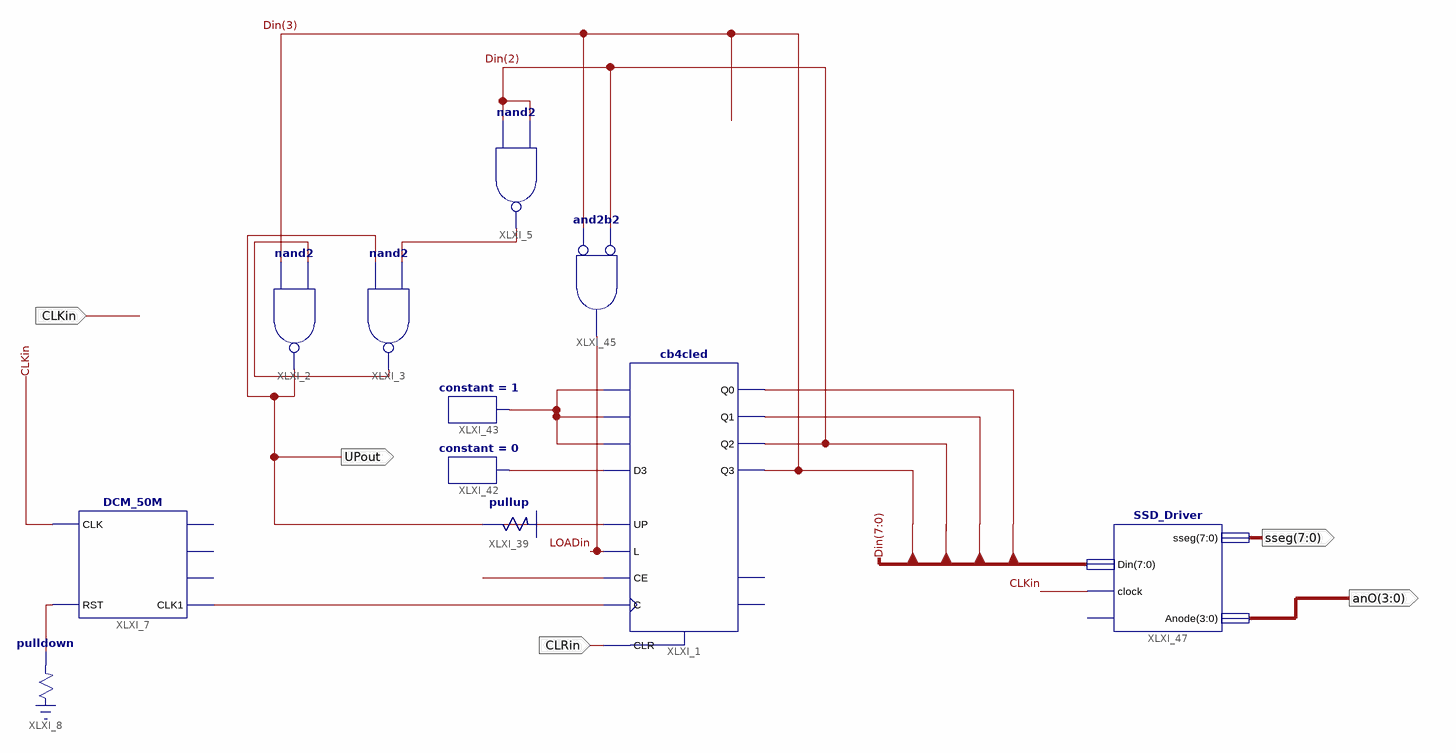
[diagram p0: schematic sheet 1]
// Xilinx ISE schematic Lab8_Experiment7.sch (spartan3e) as structural Verilog: 11 symbols, 5 ports
module Lab8_Experiment7 (
  input  CLKin,
  input  CLRin,
  output [7:0] sseg,
  output [3:0] anO,
  output UPout
);

  wire LOADin, XLXN_4, XLXN_5, XLXN_26, XLXN_43, XLXN_47, XLXN_49, XLXN_54;
  wire [7:0] Din;

  cb4cled XLXI_1 (
    .C(XLXN_5), .CE(XLXN_26), .CLR(CLRin), .D0(XLXN_54), .D1(XLXN_54), .D2(XLXN_54), .D3(XLXN_49),
    .L(LOADin), .UP(UPout), .Q0(Din[0]), .Q1(Din[1]), .Q2(Din[2]), .Q3(Din[3]));  // open: CEO, TC
  DCM_50M XLXI_7 (.CLK(CLKin), .RST(XLXN_4), .CLK1(XLXN_5));  // open: CLK1M, CLK10k, CLK1k
  \pulldown  XLXI_8 (.O(XLXN_4));
  \pullup  XLXI_39 (.O(XLXN_26));
  nand XLXI_5 (XLXN_47, Din[2], Din[2]);
  nand XLXI_2 (UPout, Din[3], XLXN_43);
  nand XLXI_3 (XLXN_43, UPout, XLXN_47);
  constant #(.CValue("0")) XLXI_42 (.O(XLXN_49));
  constant #(.CValue("1")) XLXI_43 (.O(XLXN_54));
  and XLXI_45 (LOADin, ~Din[3], ~Din[2]);  // and2b2
  SSD_Driver XLXI_47 (.Din(Din), .clock(CLKin), .sseg(sseg), .Anode(anO));  // open: ButtonEn
endmodule
